# EAGLE schematic Inverter_Half_H-Bridge_20A_50khz (EAGLE 6.1)
High Speed Half H-Bridge 50khz switching speed (100khz update using symmetric PWM), 20A half H-Bridge Use 2x of this circuit for a brushled DC motor. Use 3x of this circuit for a brushless DC motor. P Channel MOSFET IRF9310PBF <http://www.irf.com/product-info/datasheets/data/irf9310pbf.pdf> N Channel MOSFET SI4154DY <http://www.vishay.com/docs/65000/si4154dy.pdf> Gate Driver ZXGD3004E6TA <http://www.diodes.com/datasheets/ZXGD3004E6.pdf> N Channel MOSFET PMF290XN <http://www.nxp.com/documents/data_sheet/PMF290XN.pdf> Flyback Diode NSR0340V2T1G <http://www.onsemi.com/pub_link/Collateral/NSR0340V2T1-D.PDF> Connect INV_OUTx to the load (motor, etc.) Connect PWM_Hx to the PWMxH microcontroller pin Connect PWM_Lx to the PWMxL microcontroller pin
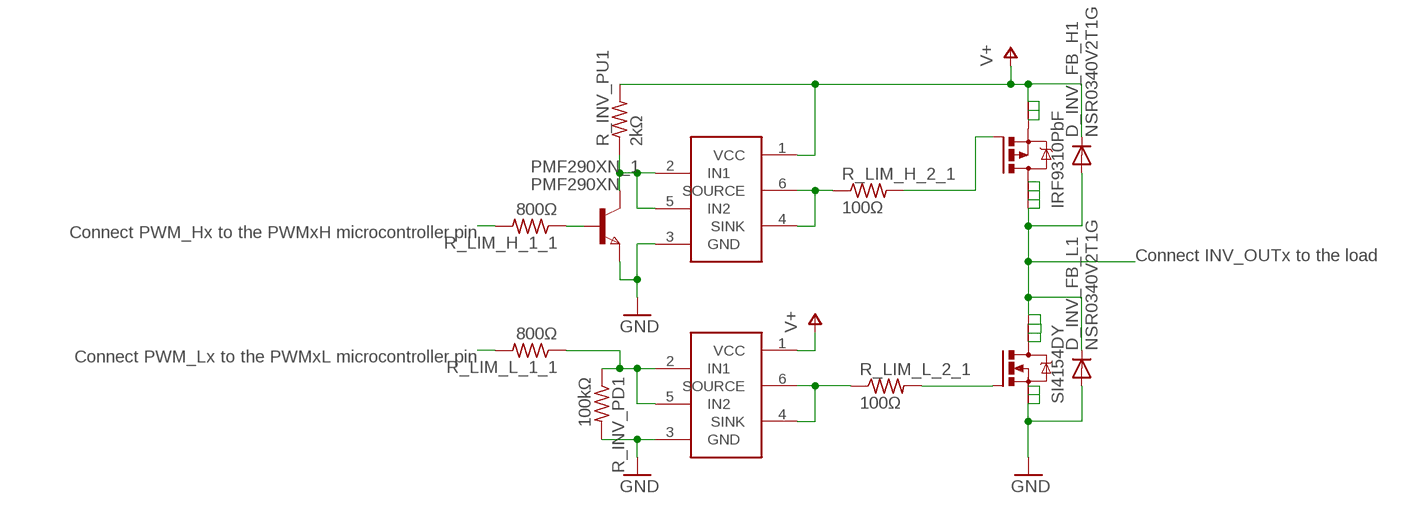
[diagram p0: schematic, sheet 1]

## Parts
D_INV_FB_H1  NSR0340V2T1G  DIODE-SOD523  [SOD523]
D_INV_FB_L1  NSR0340V2T1G  DIODE-SOD523  [SOD523]
IRF9310PBF_1  IRF9310PbF  P-MOSFET-SO8  [SO-08]
PMF290XN_1  PMF290XN  NPNSOT323  [SOT323]
R_INV_PD1  100kΩ  R-US_R0603  [R0603]
R_INV_PU1  2kΩ  R-US_R0603  [R0603]
R_LIM_H_1_1  800Ω  R-US_R0603  [R0603]
R_LIM_H_2_1  100Ω  R-US_R0603  [R0603]
R_LIM_L_1_1  800Ω  R-US_R0603  [R0603]
R_LIM_L_2_1  100Ω  R-US_R0603  [R0603]
SI4154DY_1  SI4154DY  N-MOSFET-SO8S  [SO-08]
ZXGD3004E6_H_1  ZXGD3004E6  [SOT23-6]
ZXGD3004E6_L_1  ZXGD3004E6  [SOT23-6]

## Nets
GATE_DRV_HIGH_IN1: PMF290XN_1.1(C) R_INV_PU1.1 ZXGD3004E6_H_1.2(IN1) ZXGD3004E6_H_1.5(IN2)
GATE_DRV_LOW_IN1: R_INV_PD1.1 R_LIM_L_1_1.1 ZXGD3004E6_L_1.2(IN1) ZXGD3004E6_L_1.5(IN2)
GND: D_INV_FB_L1.A PMF290XN_1.3(E) R_INV_PD1.2 SI4154DY_1.1(S) SI4154DY_1.2(S) SI4154DY_1.3(S) ZXGD3004E6_H_1.3(GND) ZXGD3004E6_L_1.3(GND)
INV_HIGH_GATE1: IRF9310PBF_1.4(G) R_LIM_H_2_1.2
INV_HIGH_GSS1: R_LIM_H_2_1.1 ZXGD3004E6_H_1.4(SINK) ZXGD3004E6_H_1.6(SOURCE)
INV_LOW_GATE1: R_LIM_L_2_1.2 SI4154DY_1.4(G)
INV_LOW_GSS1: R_LIM_L_2_1.1 ZXGD3004E6_L_1.4(SINK) ZXGD3004E6_L_1.6(SOURCE)
INV_OUT1: D_INV_FB_H1.A D_INV_FB_L1.C IRF9310PBF_1.5(D) IRF9310PBF_1.6(D) IRF9310PBF_1.7(D) IRF9310PBF_1.8(D) SI4154DY_1.5(D) SI4154DY_1.6(D) SI4154DY_1.7(D) SI4154DY_1.8(D)
N$30: PMF290XN_1.2(B) R_LIM_H_1_1.1
PWM_H: R_LIM_H_1_1.2
PWM_L: R_LIM_L_1_1.2
V+: D_INV_FB_H1.C IRF9310PBF_1.1(S) IRF9310PBF_1.2(S) IRF9310PBF_1.3(S) R_INV_PU1.2 ZXGD3004E6_H_1.1(VCC) ZXGD3004E6_L_1.1(VCC)

## Notes on the sheet
- Connect PWM_Hx to the PWMxH microcontroller pin
- Connect INV_OUTx to the load
- Connect PWM_Lx to the PWMxL microcontroller pin

## Library data of the parts
D_INV_FB_H1 D_INV_FB_L1 = diode:DIODE-: DIODE
IRF9310PBF_1 = transistor-power:P-MOSFET-SO8: P-Channel MOSFET Example: FDS4435A; P-Channel Logic Level PowerTrench® MOSFET FDS4465; P-Channel 1.8V Specified PowerTrench® MOSFET Source: www.fairchildsemi.com
PMF290XN_1 = zetex:NPNSOT323: NPN TRANSISTOR
R_INV_PD1 = resistor:R-US_: RESISTOR, American symbol; LINK: http://search.digikey.com/scripts/DkSearch/dksus.dll?Detail&itemSeq=101345852&uq=634438181961297244; ORDERED: 100; PART#: RNCP0603FTD825RCT-ND; VENDOR: Digikey
R_INV_PU1 R_LIM_H_1_1 R_LIM_H_2_1 R_LIM_L_1_1 R_LIM_L_2_1 = resistor:R-US_: RESISTOR, American symbol
SI4154DY_1 = transistor-power:N-MOSFET-SO8: N-Channel MOSFET Example: FDS7760A; N-Channel Logic Level PowerTrench® MOSFET FDS2572; N-Channel UltraFET® Trench MOSFET Source: www.fairchildsemi.com
ZXGD3004E6_H_1 ZXGD3004E6_L_1 = piccoli:ZXGD3004E6

## Net classes
4 xxwide: width 0.203 mm